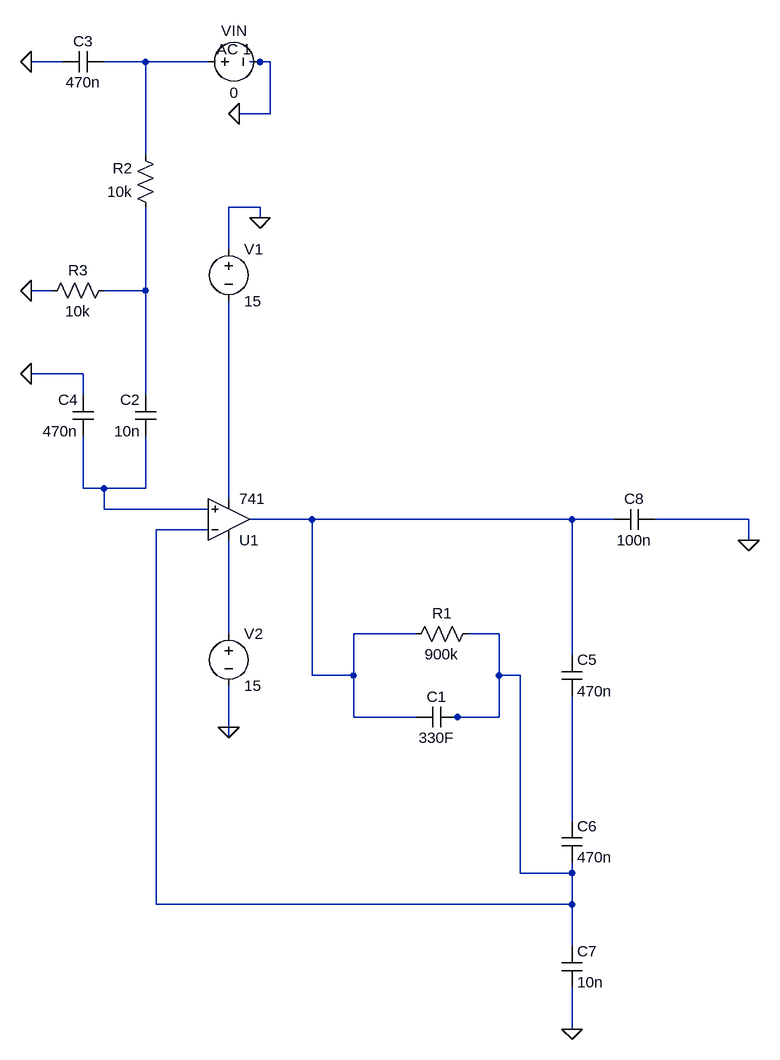
[diagram p0: schematic lab circuit.asc]
lab circuit.asc, the LTspice schematic file:
Version 4.1
SHEET 1 1256 980
WIRE -48 -560 -96 -560
WIRE 80 -560 16 -560
WIRE 176 -560 80 -560
WIRE 256 -560 240 -560
WIRE 272 -560 256 -560
WIRE 272 -480 272 -560
WIRE 272 -480 224 -480
WIRE 80 -416 80 -560
WIRE 256 -336 208 -336
WIRE 256 -320 256 -336
WIRE 208 -272 208 -336
WIRE -64 -208 -96 -208
WIRE 80 -208 80 -336
WIRE 80 -208 16 -208
WIRE -16 -80 -96 -80
WIRE -16 -48 -16 -80
WIRE 80 -48 80 -208
WIRE -16 96 -16 16
WIRE 16 96 -16 96
WIRE 80 96 80 16
WIRE 80 96 16 96
WIRE 208 112 208 -192
WIRE 16 128 16 96
WIRE 176 128 16 128
WIRE 336 144 240 144
WIRE 736 144 336 144
WIRE 800 144 736 144
WIRE 1008 144 864 144
WIRE 176 160 96 160
WIRE 1008 176 1008 144
WIRE 208 320 208 176
WIRE 496 320 400 320
WIRE 624 320 576 320
WIRE 736 352 736 144
WIRE 336 384 336 144
WIRE 400 384 400 320
WIRE 400 384 336 384
WIRE 624 384 624 320
WIRE 656 384 624 384
WIRE 400 448 400 384
WIRE 496 448 400 448
WIRE 560 448 544 448
WIRE 624 448 624 384
WIRE 624 448 560 448
WIRE 208 464 208 400
WIRE 208 480 208 464
WIRE 736 608 736 416
WIRE 656 688 656 384
WIRE 736 688 736 672
WIRE 736 688 656 688
WIRE 96 736 96 160
WIRE 736 736 96 736
WIRE 736 736 736 688
WIRE 736 800 736 736
WIRE 736 928 736 864
FLAG 256 -320 0
FLAG 208 464 0
FLAG 1008 176 0
FLAG 736 928 0
FLAG -96 -80 0
FLAG -96 -208 0
FLAG -96 -560 0
FLAG 224 -480 0
SYMBOL OpAmps\\opamp2 208 208 M180
SYMATTR InstName U1
SYMATTR Value 741
SYMBOL voltage 208 -288 R0
SYMATTR InstName V1
SYMATTR Value 15
SYMBOL voltage 208 304 R0
SYMATTR InstName V2
SYMATTR Value 15
SYMBOL cap 864 128 R90
WINDOW 0 0 32 VBottom 2
WINDOW 3 32 32 VTop 2
SYMATTR InstName C8
SYMATTR Value 100n
SYMBOL cap 720 352 R0
SYMATTR InstName C5
SYMATTR Value 470n
SYMBOL cap 720 608 R0
SYMATTR InstName C6
SYMATTR Value 470n
SYMBOL cap 720 800 R0
SYMATTR InstName C7
SYMATTR Value 10n
SYMBOL res 592 304 R90
WINDOW 0 0 56 VBottom 2
WINDOW 3 32 56 VTop 2
SYMATTR InstName R1
SYMATTR Value 900k
SYMBOL cap 560 432 R90
WINDOW 0 0 32 VBottom 2
WINDOW 3 32 32 VTop 2
SYMATTR InstName C1
SYMATTR Value 330F
SYMBOL cap 0 16 R180
WINDOW 0 24 56 Left 2
WINDOW 3 24 8 Left 2
SYMATTR InstName C4
SYMATTR Value 470n
SYMBOL cap 96 16 R180
WINDOW 0 24 56 Left 2
WINDOW 3 24 8 Left 2
SYMATTR InstName C2
SYMATTR Value 10n
SYMBOL res 96 -320 R180
WINDOW 0 36 76 Left 2
WINDOW 3 36 40 Left 2
SYMATTR InstName R2
SYMATTR Value 10k
SYMBOL res 32 -224 R90
WINDOW 0 0 56 VBottom 2
WINDOW 3 32 56 VTop 2
SYMATTR InstName R3
SYMATTR Value 10k
SYMBOL cap 16 -576 R90
WINDOW 0 0 32 VBottom 2
WINDOW 3 32 32 VTop 2
SYMATTR InstName C3
SYMATTR Value 470n
SYMBOL voltage 160 -560 R270
WINDOW 0 32 56 VTop 2
WINDOW 3 -32 56 VBottom 2
WINDOW 123 4 56 VTop 2
WINDOW 39 0 0 Left 0
SYMATTR InstName VIN
SYMATTR Value 0
SYMATTR Value2 AC 1

The netlist it stands for:
* lab circuit.asc
X§U1 N003 N006 N007 N004 N005 741  ; pins In+ In- V+ V- OUT
V1 0 N004 15
V2 N007 0 15
C8 0 N005 100n
C5 N005 N008 470n
C6 N008 N006 470n
C7 N006 0 10n
R1 N006 N005 900k
C1 N006 N005 330F
C4 N003 0 470n
C2 N003 N002 10n
R2 N002 N001 10k
R3 N002 0 10k
C3 N001 0 470n
VIN N001 0 0 AC 1
.backanno
.end